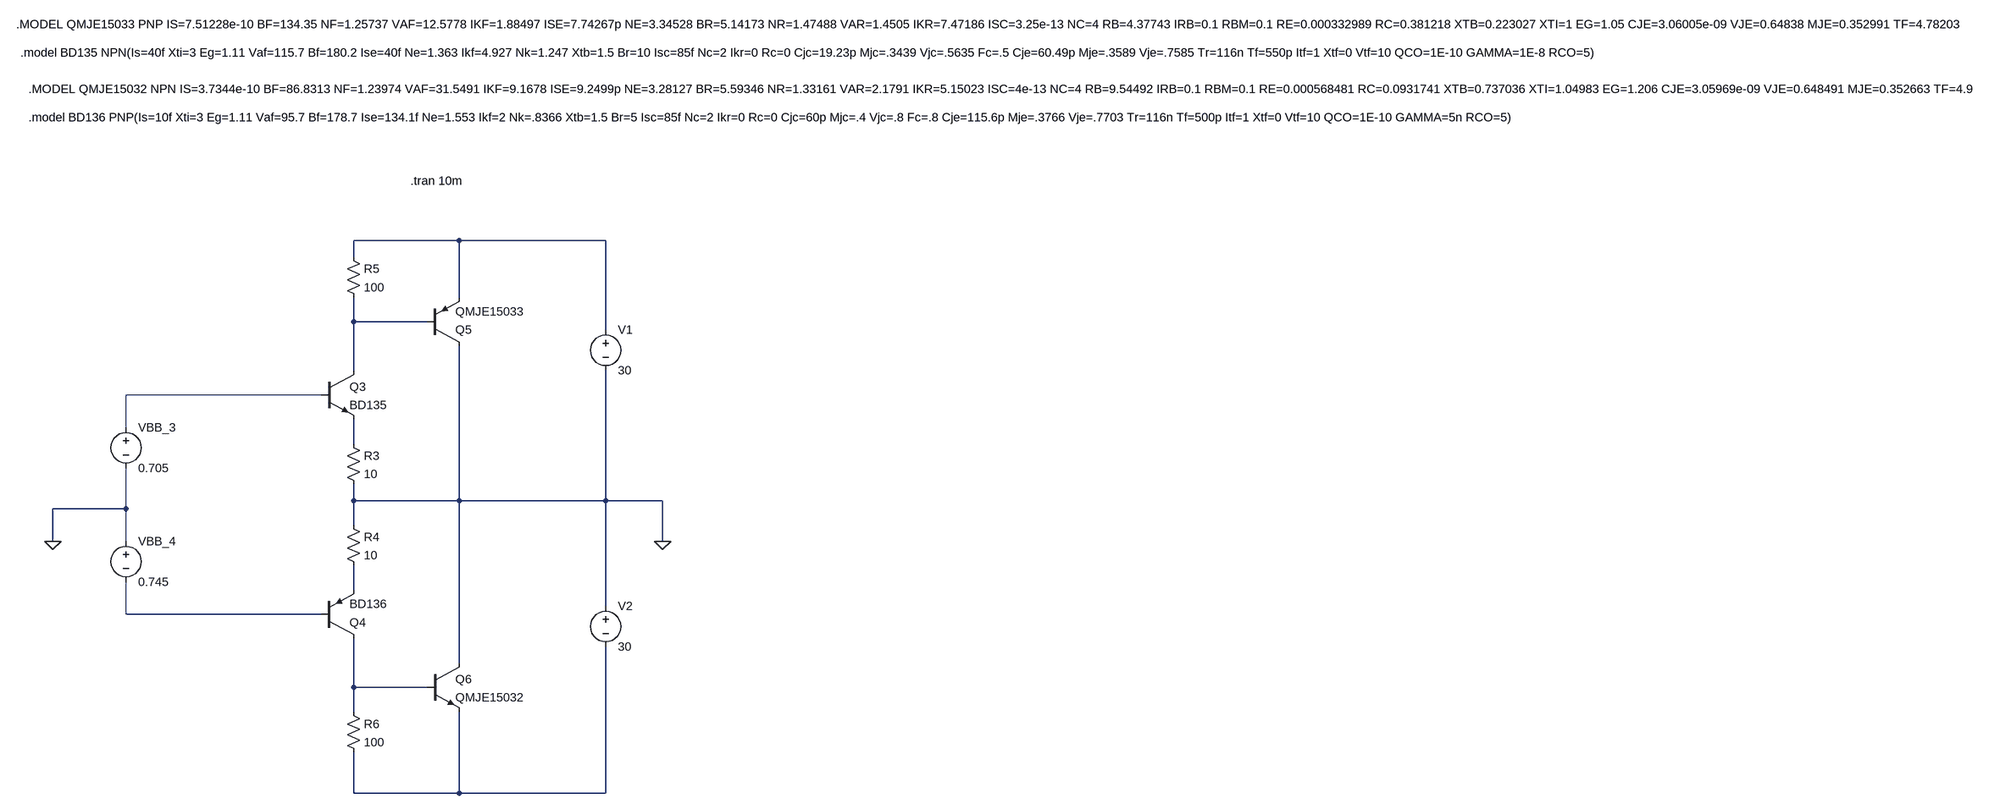
[diagram p0: schematic Potencia.asc]
Potencia.asc, the LTspice schematic file:
Version 4
SHEET 1 4924 1136
WIRE -16 -32 -224 -32
WIRE 272 -32 -16 -32
WIRE -224 0 -224 -32
WIRE -16 80 -16 -32
WIRE -224 128 -224 80
WIRE -80 128 -224 128
WIRE 272 144 272 -32
WIRE -224 224 -224 128
WIRE -288 272 -672 272
WIRE -672 336 -672 272
WIRE -224 368 -224 320
WIRE -224 480 -224 448
WIRE -16 480 -16 176
WIRE -16 480 -224 480
WIRE 272 480 272 224
WIRE 272 480 -16 480
WIRE 384 480 272 480
WIRE -672 496 -672 416
WIRE -672 496 -816 496
WIRE -224 528 -224 480
WIRE -816 560 -816 496
WIRE -672 560 -672 496
WIRE 384 560 384 480
WIRE -224 656 -224 608
WIRE 272 688 272 480
WIRE -672 704 -672 640
WIRE -288 704 -672 704
WIRE -16 800 -16 480
WIRE -224 848 -224 752
WIRE -80 848 -224 848
WIRE -224 896 -224 848
WIRE -224 1056 -224 976
WIRE -16 1056 -16 896
WIRE -16 1056 -224 1056
WIRE 272 1056 272 768
WIRE 272 1056 -16 1056
FLAG 384 560 0
FLAG -816 560 0
SYMBOL npn -288 224 R0
SYMATTR InstName Q3
SYMATTR Value BD135
SYMBOL pnp -80 176 M180
SYMATTR InstName Q5
SYMATTR Value QMJE15033
SYMBOL voltage -672 320 R0
SYMATTR InstName VBB_3
SYMATTR Value 0.705
SYMBOL voltage 272 128 R0
SYMATTR InstName V1
SYMATTR Value 30
SYMBOL res -240 -16 R0
SYMATTR InstName R5
SYMATTR Value 100
SYMBOL res -240 352 R0
SYMATTR InstName R3
SYMATTR Value 10
SYMBOL pnp -288 752 M180
SYMATTR InstName Q4
SYMATTR Value BD136
SYMBOL npn -80 800 R0
SYMATTR InstName Q6
SYMATTR Value QMJE15032
SYMBOL res -240 880 R0
SYMATTR InstName R6
SYMATTR Value 100
SYMBOL res -240 512 R0
SYMATTR InstName R4
SYMATTR Value 10
SYMBOL voltage 272 672 R0
SYMATTR InstName V2
SYMATTR Value 30
SYMBOL voltage -672 544 R0
SYMATTR InstName VBB_4
SYMATTR Value 0.745
TEXT -112 -160 Left 2 !.tran 10m
TEXT -880 -584 Left 2 !.model BD135 NPN(Is=40f Xti=3 Eg=1.11 Vaf=115.7 Bf=180.2 Ise=40f Ne=1.363 Ikf=4.927 Nk=1.247 Xtb=1.5 Br=10 Isc=85f Nc=2 Ikr=0 Rc=0 Cjc=19.23p Mjc=.3439 Vjc=.5635 Fc=.5 Cje=60.49p Mje=.3589 Vje=.7585 Tr=116n Tf=550p Itf=1 Xtf=0 Vtf=10 QCO=1E-10 GAMMA=1E-8 RCO=5)
TEXT -888 -640 Left 2 !.MODEL QMJE15033 PNP IS=7.51228e-10 BF=134.35 NF=1.25737 VAF=12.5778 IKF=1.88497 ISE=7.74267p NE=3.34528 BR=5.14173 NR=1.47488 VAR=1.4505 IKR=7.47186 ISC=3.25e-13 NC=4 RB=4.37743 IRB=0.1 RBM=0.1 RE=0.000332989 RC=0.381218 XTB=0.223027 XTI=1 EG=1.05 CJE=3.06005e-09 VJE=0.64838 MJE=0.352991 TF=4.78203e-09 XTF=1.50001 VTF=1.00006 ITF=0.999988 CJC=3.00101e-10 VJC=0.600019 MJC=0.409916 XCJC=0.8 FC=0.534975 TR=1e-07
TEXT -864 -512 Left 2 !.MODEL QMJE15032 NPN IS=3.7344e-10 BF=86.8313 NF=1.23974 VAF=31.5491 IKF=9.1678 ISE=9.2499p NE=3.28127 BR=5.59346 NR=1.33161 VAR=2.1791 IKR=5.15023 ISC=4e-13 NC=4 RB=9.54492 IRB=0.1 RBM=0.1 RE=0.000568481 RC=0.0931741 XTB=0.737036 XTI=1.04983 EG=1.206 CJE=3.05969e-09 VJE=0.648491 MJE=0.352663 TF=4.94819e-09 XTF=1.50001 VTF=1.0001 ITF=0.999982 CJC=3.00108e-10 VJC=0.600021 MJC=0.40991 XCJC=0.8 FC=0.534651 TR=1e-07
TEXT -864 -456 Left 2 !.model BD136 PNP(Is=10f Xti=3 Eg=1.11 Vaf=95.7 Bf=178.7 Ise=134.1f Ne=1.553 Ikf=2 Nk=.8366 Xtb=1.5 Br=5 Isc=85f Nc=2 Ikr=0 Rc=0 Cjc=60p Mjc=.4 Vjc=.8 Fc=.8 Cje=115.6p Mje=.3766 Vje=.7703 Tr=116n Tf=500p Itf=1 Xtf=0 Vtf=10 QCO=1E-10 GAMMA=5n RCO=5)

The netlist it stands for:
* Potencia.asc
Q3 N002 N003 N004 0 BD135
Q5 0 N002 N001 0 QMJE15033
VBB_3 N003 0 0.705
V1 N001 0 30
R5 N001 N002 100
R3 N004 0 10
Q4 N007 N006 N005 0 BD136
Q6 0 N007 N008 0 QMJE15032
R6 N007 N008 100
R4 0 N005 10
V2 0 N008 30
VBB_4 0 N006 0.745
.model NPN NPN
.model PNP PNP
.lib standard.bjt
.tran 10m
.model BD135 NPN(Is=40f Xti=3 Eg=1.11 Vaf=115.7 Bf=180.2 Ise=40f Ne=1.363 Ikf=4.927 Nk=1.247 Xtb=1.5 Br=10 Isc=85f Nc=2 Ikr=0 Rc=0 Cjc=19.23p Mjc=.3439 Vjc=.5635 Fc=.5 Cje=60.49p Mje=.3589 Vje=.7585 Tr=116n Tf=550p Itf=1 Xtf=0 Vtf=10 QCO=1E-10 GAMMA=1E-8 RCO=5)
.MODEL QMJE15033 PNP IS=7.51228e-10 BF=134.35 NF=1.25737 VAF=12.5778 IKF=1.88497 ISE=7.74267p NE=3.34528 BR=5.14173 NR=1.47488 VAR=1.4505 IKR=7.47186 ISC=3.25e-13 NC=4 RB=4.37743 IRB=0.1 RBM=0.1 RE=0.000332989 RC=0.381218 XTB=0.223027 XTI=1 EG=1.05 CJE=3.06005e-09 VJE=0.64838 MJE=0.352991 TF=4.78203e-09 XTF=1.50001 VTF=1.00006 ITF=0.999988 CJC=3.00101e-10 VJC=0.600019 MJC=0.409916 XCJC=0.8 FC=0.534975 TR=1e-07
.MODEL QMJE15032 NPN IS=3.7344e-10 BF=86.8313 NF=1.23974 VAF=31.5491 IKF=9.1678 ISE=9.2499p NE=3.28127 BR=5.59346 NR=1.33161 VAR=2.1791 IKR=5.15023 ISC=4e-13 NC=4 RB=9.54492 IRB=0.1 RBM=0.1 RE=0.000568481 RC=0.0931741 XTB=0.737036 XTI=1.04983 EG=1.206 CJE=3.05969e-09 VJE=0.648491 MJE=0.352663 TF=4.94819e-09 XTF=1.50001 VTF=1.0001 ITF=0.999982 CJC=3.00108e-10 VJC=0.600021 MJC=0.40991 XCJC=0.8 FC=0.534651 TR=1e-07
.model BD136 PNP(Is=10f Xti=3 Eg=1.11 Vaf=95.7 Bf=178.7 Ise=134.1f Ne=1.553 Ikf=2 Nk=.8366 Xtb=1.5 Br=5 Isc=85f Nc=2 Ikr=0 Rc=0 Cjc=60p Mjc=.4 Vjc=.8 Fc=.8 Cje=115.6p Mje=.3766 Vje=.7703 Tr=116n Tf=500p Itf=1 Xtf=0 Vtf=10 QCO=1E-10 GAMMA=5n RCO=5)
.backanno
.end